# EasyEDA Pro project luabox.eprj

# Schematic Schematic1
Board Name: Board1; Create Date: 2025-08-20; Page Name: P1; Project Name: luabox; Schematic Name: Schematic1; Update Date: 2025-08-20; Company: EasyEDA.com; Page Size: A4; Version: V1.0
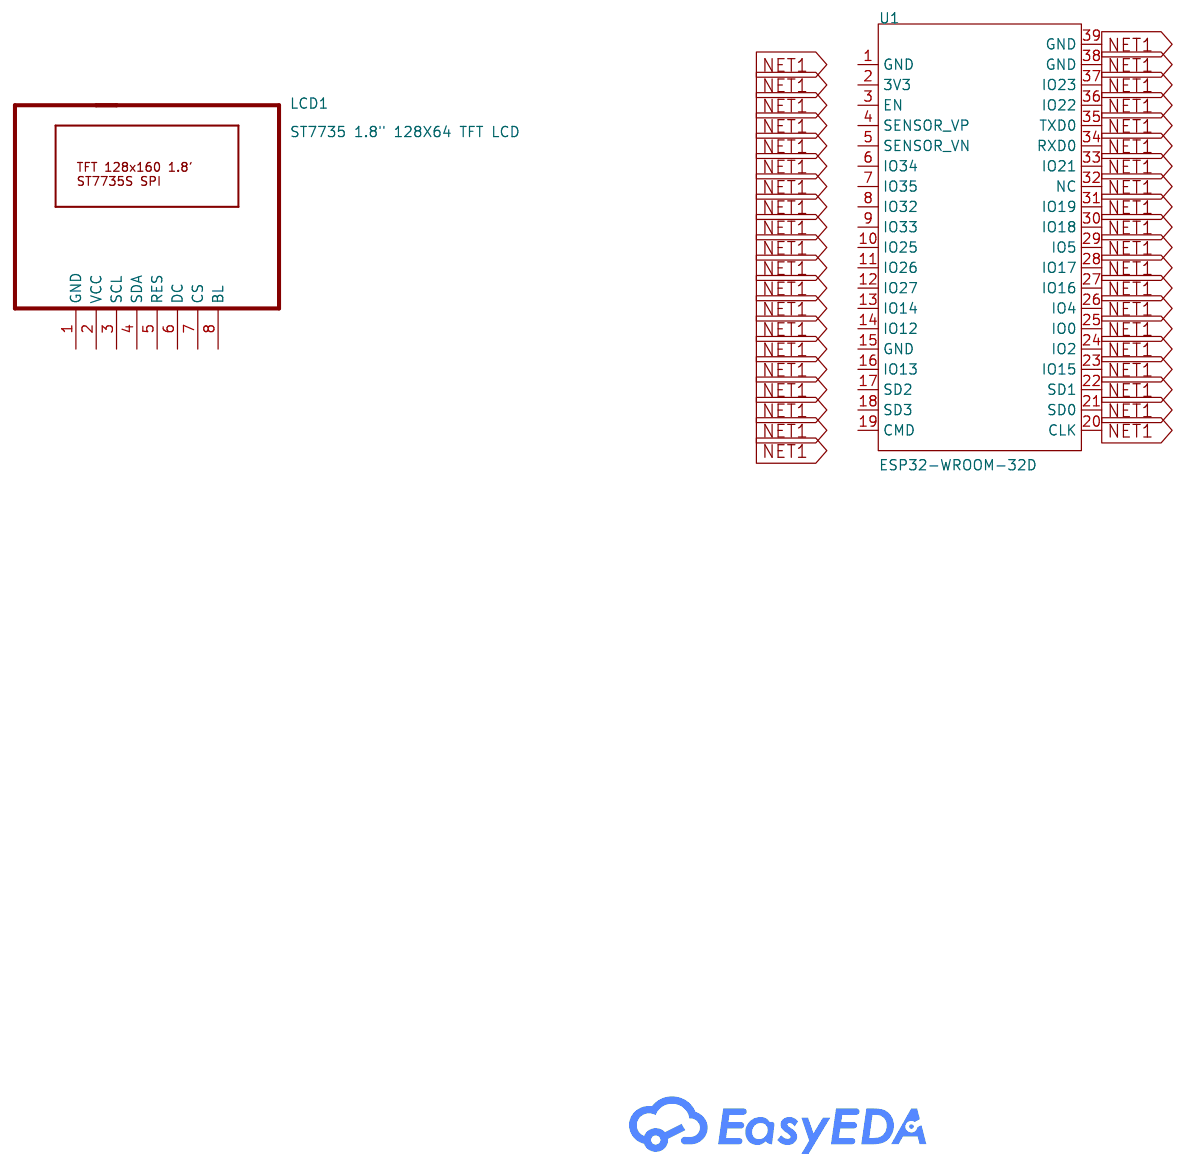
[diagram p0: schematic sheet]

## Parts
LCD1  ST7735 1.8" 128X64 TFT LCD
U1  ESP32-WROOM-32D  [WIFIM-SMD_ESP32-WROOM-32D]

## Library data of the parts
LCD1 = ST7735 1.8" 128X64 TFT LCD
U1 = ESP32-WROOM-32D: Supplier Part: C503588; JLCPCB Part Class: Extended Part; Supplier: LCSC

## Nets
NET1: U1.20(CLK) U1.21(SD0) U1.22(SD1) U1.23(IO15) U1.24(IO2) U1.25(IO0) U1.26(IO4) U1.27(IO16) U1.28(IO17) U1.29(IO5) U1.30(IO18) U1.31(IO19) U1.32(NC) U1.33(IO21) U1.34(RXD0) U1.35(TXD0) U1.36(IO22) U1.37(IO23) U1.38(GND) U1.39(GND)

Not connected (* = marked no-connect by the designer): LCD1 1(GND) 2(VCC) 3(SCL) 4(SDA) 5(RES) 6(DC) 7(CS) 8(BL); U1 1(GND) 2(3V3) 3(EN) 4(SENSOR_VP) 5(SENSOR_VN) 6(IO34) 7(IO35) 8(IO32) 9(IO33) 10(IO25) 11(IO26) 12(IO27) 13(IO14) 14(IO12) 15(GND) 16(IO13) 17(SD2) 18(SD3) 19(CMD)
